# Altium schematic sheet Pg6-Power supply 3.SchDoc: Isolated Poser Supply 3
size 431 x 279 mm; Date: Not shown in title block; ApprovedBy: Not shown in title block; CheckedBy: Not shown in title block; Author: Not shown in title block; CompanyName: Not shown in title block; Engineer: Not shown in title block; Organization: Not shown in title block; Address1: Not shown in title block; Address2: Not shown in title block; Address3: Not shown in title block; Address4: Not shown in title block; DocumentNumber: 6; Revision: Use project parameter SCH_Rev; SheetNumber: 6; SheetTotal: 7; PageSetup: Record=PageOptions|CenterHorizontal=True|CenterVertical=True|PrintScale=1.00|XCorrection=1.00|YCorrection=1.00|PrintKind=0|BorderSize=5000000|LeftOffset=0|BottomOffset=0|Orientation=2|PaperLength=1000|PaperWidth=1000|Scale=100|PaperSource=15|PrintQuality=600|MediaType=1|DitherType=10|PaperKind=Letter|PrintScaleMode=1; CurrentTime: Not shown in title block; CurrentDate: Not shown in title block; Time: Not shown in title block; DocumentFullPathAndName: Not shown in title block; DocumentName: Not shown in title block; ModifiedDate: Not shown in title block; ImagePath: Not shown in title block
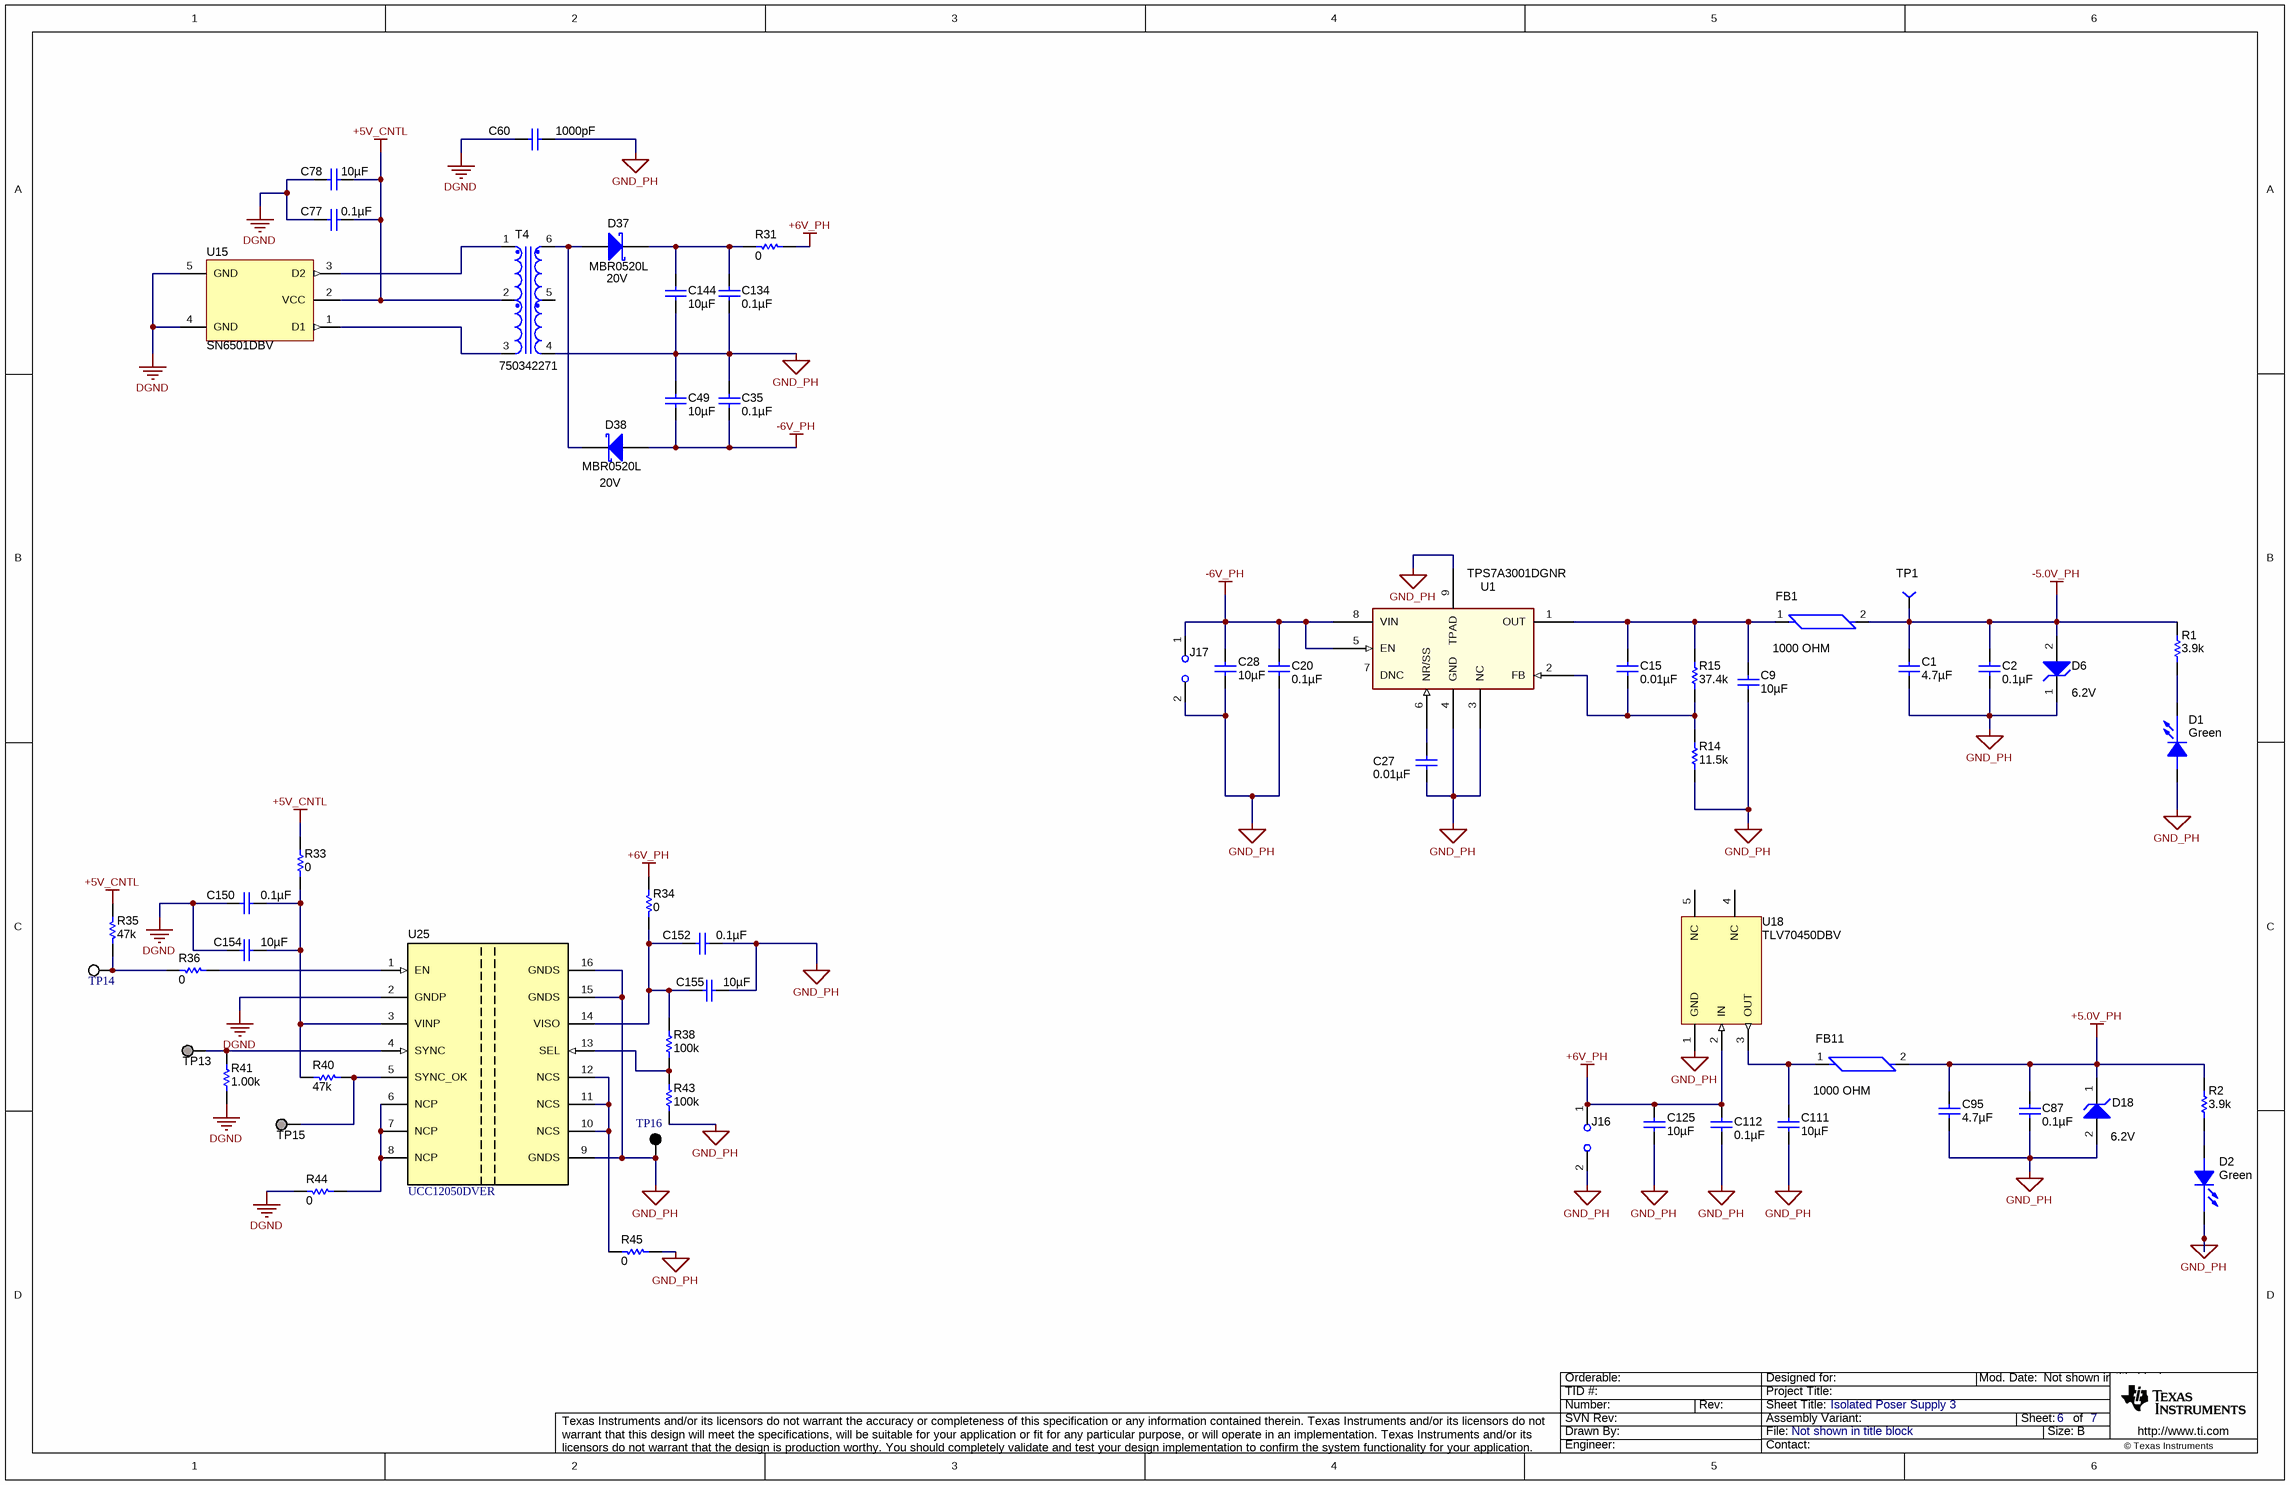
[diagram p0: Pg6-Power supply 3.SchDoc]

## Parts
C1  ValueDisplayed: 4.7µF  [0805_HV]
C2  ValueDisplayed: 0.1µF  [0603]
C9  ValueDisplayed: 10µF  [1210]
C15  ValueDisplayed: 0.01µF  [0603]
C20  ValueDisplayed: 0.1µF  [0603]
C27  ValueDisplayed: 0.01µF  [0603]
C28  ValueDisplayed: 10µF  [1210]
C35  ValueDisplayed: 0.1µF  [0603]
C49  ValueDisplayed: 10µF  [1210]
C60  value 1000pF  [CAP_200mil]
C77  ValueDisplayed: 0.1µF  [0603]
C78  ValueDisplayed: 10µF  [1210]
C87  ValueDisplayed: 0.1µF  [0603]
C95  ValueDisplayed: 4.7µF  [0805_HV]
C111  ValueDisplayed: 10µF  [1210]
C112  ValueDisplayed: 0.1µF  [0603]
C125  ValueDisplayed: 10µF  [1210]
C134  ValueDisplayed: 0.1µF  [0603]
C144  ValueDisplayed: 10µF  [1210]
C150  ValueDisplayed: 0.1µF  [0603]  (hidden comment: C0603C104K5RACTU)
C152  ValueDisplayed: 0.1µF  [0603]  (hidden comment: C0603C104K5RACTU)
C154  ValueDisplayed: 10µF  [1206_180]  (hidden comment: GRM31CR61H106KA12L)
C155  ValueDisplayed: 10µF  [1206_180]  (hidden comment: GRM31CR61H106KA12L)
D1  value Green  [LED0603AA]
D2  value Green  [LED0603AA]
D6  value 6.2V  [powerDI123]
D18  value 6.2V  [powerDI123]
D37  MBR0520L  value 20V  [SOD-123]
D38  MBR0520L  value 20V  [SOD-123]
FB1  value 1000 OHM  [FB0603]
FB11  value 1000 OHM  [FB0603]
J16  (no value)  [HDR100_1X2]
J17  (no value)  [HDR100_1X2]
R1  value 3.9k  [0603]
R2  value 3.9k  [0603]
R14  value 11.5k  [0603]
R15  value 37.4k  [0603]
R31  value 0  [0402M]  (hidden comment: RC0402JR-070RL)
R33  ValueDisplayed: 0  [0603]  (hidden comment: CRCW06030000Z0EA)
R34  ValueDisplayed: 0  [0603]  (hidden comment: CRCW06030000Z0EA)
R35  ValueDisplayed: 47k  [0603]  (hidden comment: RC0603JR-0747KL)
R36  value 0  [0402M]  (hidden comment: RC0402JR-070RL)
R38  ValueDisplayed: 100k  [0603]  (hidden comment: CRCW0603100KFKEA)
R40  ValueDisplayed: 47k  [0603]  (hidden comment: RC0603JR-0747KL)
R41  ValueDisplayed: 1.00k  [0402]  (hidden comment: ERJ-2RKF1001X)
R43  ValueDisplayed: 100k  [0603]  (hidden comment: CRCW0603100KFKEA)
R44  value 0  [0402M]  (hidden comment: RC0402JR-070RL)
R45  value 0  [0402M]  (hidden comment: RC0402JR-070RL)
T4  750342271  [760390015]
TP1  (no value)  [TP-040_RND]
TP13  Pogo Pad  [PogoPad]  (value not drawn)  (no BOM)
TP14  5002  [Keystone5002]  (value not drawn)
TP15  Pogo Pad  [PogoPad]  (value not drawn)  (no BOM)
TP16  5001  [Keystone5001]  (value not drawn)
U1  (no value)  [MSOP8(DGN)]
U15  SN6501DBV  [DBV0005A_N]
U18  TLV70450DBV  [DBV0005A_N]
U25  UCC12050DVER  [DVE0016A]

## Nets
+5.0V_PH: C87.1 C95.2 D18.1(K) FB11.2 R2.2
+5V_CNTL: C77.2 C78.2 R33.2 R35.2 T4.2 U15.2(VCC)
+6V_PH: C112.1 C125.2 J16.1 R31.1 R34.2 U18.2(IN)
-5.0V_PH: C1.2 C2.1 D6.2(A) FB1.2 R1.2 TP1.1
-6V_PH: C20.1 C28.2 C35.2 C49.2 D38.2(A) J17.1 U1.5(EN) U1.8(VIN)
DGND: C60.1 C77.1 C78.1 C150.1 C154.2 R41.1 R44.2 U15.4(GND) U15.5(GND) U25.2(GNDP)
GND_PH: C1.1 C2.2 C9.1 C20.2 C27.1 C28.1 C35.1 C49.1 C60.2 C87.2 C95.1 C111.1 C112.2 C125.1 C134.2 C144.2 C152.1 C155.1 D1.2(A) D2.1(C) D6.1(K) D18.2(A) J16.2 J17.2 R14.1 R43.1 R45.1 T4.4 TP16.1 U1.3(NC) U1.4(GND) U1.9(TPAD) U18.1(GND) U25.9(GNDS) U25.15(GNDS) U25.16(GNDS)
NetC9_2: C9.2 C15.2 FB1.1 R15.2 U1.1(OUT)
NetC15_1: C15.1 R14.2 R15.1 U1.2(FB)
NetC27_2: C27.2 U1.6(NR/SS)
NetC111_2: C111.2 FB11.1 U18.3(OUT)
NetC134_1: C134.1 C144.1 D37.1(K) R31.2
NetC150_2: C150.2 C154.1 R33.1 R40.2 U25.3(VINP)
NetC152_2: C152.2 C155.2 R34.1 R38.1 U25.14(VISO)
NetD1_1: D1.1(C) R1.1
NetD2_2: D2.2(A) R2.1
NetD37_2: D37.2(A) D38.1(K) T4.6
NetR35_1: R35.1 R36.2 TP14.1
NetR36_1: R36.1 U25.1(EN)
NetR38_2: R38.2 R43.2 U25.13(SEL)
NetR40_1: R40.1 TP15.1 U25.5(SYNC_OK)
NetR41_2: R41.2 TP13.1 U25.4(SYNC)
NetR44_1: R44.1 U25.6(NCP) U25.7(NCP) U25.8(NCP)
NetR45_2: R45.2 U25.10(NCS) U25.11(NCS) U25.12(NCS)
NetT4_1: T4.1 U15.3(D2)
NetT4_3: T4.3 U15.1(D1)

Not connected (* = marked no-connect by the designer): T4 5; U1 7(DNC); U18 4(NC) 5(NC)

## Notes on the sheet
- Drawn By:
- SVN Rev:
- Number:
- TID #:
- Orderable:
- Rev:
- Sheet Title:
- File:
- Project Title:
- Designed for:
- Assembly Variant:
- Mod. Date:
- Sheet:
- Size:
- of
- B
- http://www.ti.com
- Texas Instruments and/or its licensors do not warrant the accuracy or completeness of this specification or any information contained therein. Texas Instruments and/or its licensors do not warrant that this design will meet the specifications, will be suitable for your application or fit for any particular purpose, or will operate in an implementation. Texas Instruments and/or its licensors do not warrant that the design is production worthy. You should completely validate and test your design implementation to confirm the system functionality for your application.
- Engineer:
- Contact:
- © Texas Instruments

## Library data of the parts
C1 C95 = C2012X5R1H475K125AB: CAP, CERM, 4.7uF, 50V, +/-10%, X5R, 0805; Manufacturer: TDK; Polarized: N; CompType: Capacitor; U/M: EA; Cap_F: 0.0000047; Tolerance_%: 10; Value1: Unknown; VDC_V: 50; TaMin_C: -55; TaMax_C: 85; Cap_Case: 0805; PackageReference: 0805; PartNumber: C2012X5R1H475K125AB; SymbolVersion: 2008-07-09; Value: 4.7uF; RoHS: Y; Value2: 50V; MountType: SMT; Technology: Ceramic; Publisher: Texas Instruments; LatestRevisionDate: 2013-12-06; ComponentLink1Description: Datasheet link; ComponentLink1URL: http://product.tdk.com/capacitor/mlcc/en/productguide/pdf/mlcc_selection_guide_en_03.pdf; Supplier 1: Digi-Key; Supplier Part Number 1: 445-5980-1-ND; TempCo: X5R; Published: 2008-06-19
C2 C20 C35 C77 C87 C112 C134 C150 C152 = C0603C104K5RACTU: CAP, CERM, 0.1uF, 50V, +/-10%, X7R, 0603; Manufacturer: Kemet; Polarized: N; CompType: Capacitor; U/M: EA; Cap_F: 0.0000001; Tolerance_%: 10; Value1: Unknown; VDC_V: 50; TaMin_C: -55; TaMax_C: 125; SymbolVersion: 2008-07-09; Value: 0.1uF; PartNumber: C0603C104K5RACTU; PackageReference: 0603; RoHS: Y; Value2: 50V; MountType: SMT; Technology: Ceramic; TempCo: X7R; Cap_Case: 0603; Published: 2008-06-19; Publisher: Texas Instruments; LatestRevisionDate: 2013-12-06; ComponentLink1Description: Datasheet link; ComponentLink1URL: http://www.kemet.com/kemet/web/homepage/kechome.nsf/vapubfiles/F3102_Y5V.pdf/$file/F3102_Y5V.pdf; Supplier 1: Digi-Key; Supplier Part Number 1: 399-5089-1-ND; Supplier 2: Mouser; Supplier Part Number 2: 80-C0603C104K5R; Supplier 3: Farnell; Supplier Part Number 3: 1288255
C9 C28 C49 C78 C111 C125 C144 = GMK325AB7106MM-T: CAP, CERM, 10uF, 35V, +/-20%, X7R, 1210; Manufacturer: Taiyo Yuden; Polarized: N; CompType: Capacitor; U/M: EA; Cap_F: 0.00001; Tolerance_%: 20; Value1: Unknown; VDC_V: 35; TaMin_C: -55; TaMax_C: 125; PackageReference: 1210; PartNumber: GMK325AB7106MM-T; SymbolVersion: 2008-07-09; Value: 10uF; RoHS: Y; Value2: 35V; MountType: SMT; Technology: Ceramic; Cap_Case: 1210; Publisher: Texas Instruments; LatestRevisionDate: 2013-12-06; ComponentLink1Description: Datasheet link; ComponentLink1URL: http://www.yuden.co.jp/productdata/catalog/en/mlcc01_e.pdf; Supplier 1: Digi-Key; Supplier Part Number 1: 587-2779-1-ND; Supplier 2: Mouser; Supplier Part Number 2: 963-GMK325AB7106MM-T; Supplier 3: Farnell; Supplier Part Number 3: 1894510; TempCo: X7R; Published: 2008-06-19
C15 C27 = 06031C103JAT2A: CAP, CERM, 0.01uF, 100V, +/-5%, X7R, 0603; Manufacturer: AVX; Polarized: N; CompType: Capacitor; U/M: EA; Cap_F: 0.00000001; Tolerance_%: 5; ESR_Ohm: 0.098; Value1: 0.098 ohm; VDC_V: 100; TaMin_C: -55; TaMax_C: 125; SymbolVersion: 2008-07-09; Value: 0.01uF; PartNumber: 06031C103J4Z4A; PackageReference: 0603; RoHS: Y; Value2: 100V; MountType: SMT; Technology: Ceramic; TempCo: X7R; Cap_Case: 0603; Published: 2008-06-19; Publisher: Texas Instruments; LatestRevisionDate: 2013-11-21; ComponentLink1Description: Datasheet link; ComponentLink1URL: http://www.avx.com/docs/masterpubs/smccp.pdf; Supplier 1: Digi-Key; Supplier Part Number 1: 478-7418-1-ND; Supplier 2: Mouser; Supplier Part Number 2: 581-06031C103J; Supplier 3: Farnell; Supplier Part Number 3: 1833876
C60 = 202R18W102KV4E: CAP CER 1000PF 1KV 10% RADIAL; PartNumber: S102K29Y5PN63J5R; Manufacturer: Vishay BC Components; Polarized: N; CompType: Capacitor; Tolerance_%: 0; ValueDisplayed: 1000pF; RoHS: Y; Value2: 1kv; MountType: radial; Technology: Ceramic; Publisher: Texas Instruments; ComponentLink1Description: Datasheet link; ComponentLink1URL: http://www.johansondielectrics.com/images/stories/catalog/JDI-Product-Catalog.pdf; Supplier 1: Digi-Key; Supplier Part Number 1: 1251PH-ND
C154 C155 = GRM31CR61H106KA12L: CAP, CERM, 10 µF, 50 V, +/- 10%, X5R, 1206; Manufacturer: MuRata; Polarized: N; CompType: Capacitor; Value: 10uF; U/M: EA; Cap_F: 0.00001; Tolerance_%: 10; Value1: Unknown; VDC_V: 50; Value2: 50V; TaMin_C: -55; TaMax_C: 85; Cap_Case: 1206; SizeArea_mm2: 5.12; SizeAreaWB_mm2: 10.92; SizeX_mm: 3.2; SizeY_mm: 1.6; SizeZ_mm: 1.8; AEC Category: Q200; SymbolVersion: 2008-07-09; PartNumber: GRM31CR61H106KA12L; PackageReference: 1206; RoHS: Y; MountType: SMT; Technology: Ceramic; TempCo: X5R; Published: 2008-06-19; Publisher: Texas Instruments; LatestRevisionDate: 2016-10-28; ComponentLink1Description: Datasheet link; ComponentLink1URL: http://search.murata.co.jp/Ceramy/image/img/A01X/G101/ENG/GRM31CR61H106KA12-01.pdf; Supplier 1: Digi-Key; Supplier Part Number 1: 490-5961-1-ND; Supplier 2: Mouser; Supplier Part Number 2: 81-GRM31CR61H106KA2L; Supplier 3: Farnell; Supplier Part Number 3: 1845762RL; AEC Qualified: N; AEC Grade: N/A
D1 D2 = LED_LG L29K-G2J1-24-Z: LED SmartLED Green 570NM; Manufacturer: OSRAM; SymbolCreator: x0120606; CompType: *; PartNumber: LG L29K-G2J1-24-Z; Alternate Manufacturer: LED; PackageReference: 0603; ComponentLink1URL: http://catalog.osram-os.com/catalogue/catalogue.do;jsessionid=32CB61882C089EDD4B6D0A54E7E1F117?act=downloadFile&favOid=020000020000138e000100b6; Alternate PartNumber: *; ComponentLink1Description: Datasheet link; Supplier Part Number 1: 475-2709-2-ND; Supplier 1: Digi-Key; MountType: SMT; Publisher: TI
D6 D18 = DFLZ6V2-7: Diode, Zener, 6.2V, 1W, PowerDI123; Manufacturer: Diodes Inc.; U/M: EA; Power_W: 1; Vz_V: 6.2; RJA_CperW: 110; CompType: Zener; SymbolVersion: 2010-08-25; PartNumber: DFLZ6V2-7; PackageReference: PowerDI123; Vr_V: N/A; Value1: 1W; MountType: SMT; RoHS: Y; ComponentLink1Description: Datasheet link; ComponentLink1URL: http://www.diodes.com/datasheets/ds30464.pdf; Published: 2008-10-08; Publisher: Texas Instruments; LatestRevisionDate: 2013-11-26; LatestRevisionNote: Updated Supplier Data; Supplier 1: Digi-Key; Supplier Part Number 1: DFLZ6V2DICT-ND; Supplier 2: Mouser; Supplier Part Number 2: 621-DFLZ6V2-7; Supplier 3: Farnell; Supplier Part Number 3: 2077983
D37 D38 = MBR0520LT1G: Diode, Schottky, 20V, 0.5A, SOD-123; Manufacturer: Fairchild Semiconductor; U/M: EA; Vf_V: 0.385; Value2: 0.385V; Io_A: 0.5; Vr_V: 20; TJmax_C: 125; RJC_CperW: 150; CompType: Diode; SymbolVersion: 2008-12-08; PartNumber: MBR0520L; PackageReference: SOD-123; Value1: 0.5A; MountType: SMT; Type: Schottky; RoHS: Y; Published: 2008-06-26; Publisher: Texas Instruments; LatestRevisionDate: 2013-12-18; ComponentLink1Description: Datasheet link; ComponentLink1URL: http://www.onsemi.com/pub_link/Collateral/MBR0520LT1-D.PDF; Supplier 1: Digi-Key; Supplier Part Number 1: MBR0520LCT-ND; Supplier 2: Mouser; Supplier Part Number 2: 863-MBR0520LT1G; Supplier 3: Farnell; Supplier Part Number 3: 9556915
FB1 FB11 = MMZ1608B102C: FERRITE CHIP 1000 OHM 300MA 0603; Manufacturer: TDK Corporation; CompType: Ferrite Bead; PartNumber: MMZ1608B102C; MountType: SMT; Alternate PartNumber: *; Supplier 1: Digi-Key; ComponentLink1URL: http://www.tdk.co.jp/tefe02/e9412_mmz.pdf; ComponentLink1Description: Datasheet link; Publisher: TI; Supplier Part Number 1: 445-8672-1-ND; PackageReference: 0603; Alternate Manufacturer: *; RoHS: Y
J16 J17 = JUMPER_2X100MIL: Header, Male 2-pin, 100mil spacing,; Manufacturer: FCI; PartNumber: 68001-402HLF; area: 20000; Value: 68001-402HLF; ComponentLink1URL: \\vette02\pmp_pcb\pcad_pdf's\pec36saan.pdf; ComponentHeight: 0.330 inch; SymbolVersion: 09/30/2009 09:55:05; PackageReference: 0.100 inch x 2; ComponentLink1Description: AEO Datasheet Link; Supplier 1: Digi-Key; Supplier Part Number 1: 609-3507-ND
R1 R2 = CRCW06033K90JNEA: RES, 3.9k ohm, 5%, 0.1W, 0603; Manufacturer: Vishay-Dale; CompType: Resistor; Res_ohm: 3900; Value_Code: 3k90; Tolerance_%: 5; Power_W: 0.1; VDC_V: 75; TempCo: 200 ppm/C; EIA_Code: E24; U/M: EA; SymbolVersion: 2009-05-29; PartNumber: CRCW06033K90JNEA; PackageReference: 0603; RoHS: Y; Value1: 5%; Value2: 0.1W; MountType: SMT; Technology: Thick Film; Published: 2008-06-26; Publisher: Texas Instruments; LatestRevisionDate: 2013-10-22; ComponentLink1Description: Datasheet link; ComponentLink1URL: http://www.vishay.com/docs/20035/dcrcwe3.pdf; Supplier 1: Digi-Key; Supplier Part Number 1: 541-3.9KGCT-ND; Supplier 2: Farnell; Supplier Part Number 2: 1563917; Supplier 3: Newark; Supplier Part Number 3: 72M6834
R14 = CRCW060311K5FKEA: RES, 11.5k ohm, 1%, 0.1W, 0603; Manufacturer: Vishay-Dale; CompType: Resistor; Res_ohm: 11500; Value_Code: 11k5; Tolerance_%: 1; Power_W: 0.1; VDC_V: 75; TempCo: 100 ppm/C; EIA_Code: E96; U/M: EA; SymbolVersion: 2009-05-29; PartNumber: CRCW060311K5FKEA; PackageReference: 0603; RoHS: Y; Value1: 1%; Value2: 0.1W; MountType: SMT; Technology: Thick Film; Published: 2008-06-26; Publisher: Texas Instruments; LatestRevisionDate: 2013-10-22; ComponentLink1Description: Datasheet link; ComponentLink1URL: http://www.vishay.com/docs/20035/dcrcwe3.pdf; Supplier 1: Digi-Key; Supplier Part Number 1: 541-11.5KHCT-ND; Supplier 2: Mouser; Supplier Part Number 2: 71-CRCW0603-11.5K-E3; Supplier 3: Farnell; Supplier Part Number 3: 1469753
R15 = RT0603BRD0737KL: RES 37.4K OHM 1/10W .1% 0603 SMD; PartNumber: ERA-3AEB3742V; Manufacturer: Panasonic; CompType: Resistor; Res_ohm: 37000; Value_Code: 37k4; Tolerance_%: 0.1; Value1: 1%; Value2: 0.1W; VDC_V: 75; TempCo: 25 ppm/C; EIA_Code: E192; U/M: EA; SymbolVersion: 2009-05-29; PackageReference: 0603; RoHS: Y; Power_W: 0.1; MountType: SMT; Technology: Thin Film; Published: 2008-06-26; Publisher: Texas Instruments; LatestRevisionDate: 2013-10-22; ComponentLink1Description: Datasheet link; ComponentLink1URL: http://www.yageo.com/pdf/PYu-RT_1-to-0.05_RoHS_L_3.pdf; Supplier 1: Digi-Key; Supplier Part Number 1: P37.4KDBCT-ND
R31 R36 R44 R45 = RC0402JR-070RL: RES, 0 ohm, 5%, 0.063W, 0402; Manufacturer: Yageo America; CompType: Resistor; Value_Code: 0000; Tolerance_%: 5; Power_W: 0.063; VDC_V: 50; TempCo: 200 ppm/C; EIA_Code: E24; U/M: EA; SymbolVersion: 2009-05-29; PartNumber: RC0402JR-070RL; PackageReference: 0402; RoHS: Y; Res_ohm: 0; Value1: 5%; Value2: 0.063W; MountType: SMT; Technology: Thick Film; Published: 2008-06-26; Publisher: Texas Instruments; LatestRevisionDate: 2013-01-08; ComponentLink1Description: Datasheet link; ComponentLink1URL: http://www.yageo.com/pdf/Pu-RC0402_51_PbFree_L_2.pdf; Supplier 1: Digi-Key; Supplier Part Number 1: 311-0.0JRCT-ND; Supplier 2: Mouser; Supplier Part Number 2: 603-RC0402JR-070RL; Supplier 3: Farnell; Supplier Part Number 3: 9232516
R33 R34 = CRCW06030000Z0EA: RES, 0, 5%, 0.1 W, 0603; Manufacturer: Vishay-Dale; CompType: Resistor; Value: 0; Value_Code: 0000; Tolerance_%: 5; Power_W: 0.1; Value2: 0.1W; VDC_V: 75; TempCo: 200 ppm/C; EIA_Code: E24; U/M: EA; SymbolVersion: 2009-05-29; PartNumber: CRCW06030000Z0EA; PackageReference: 0603; RoHS: Y; Res_ohm: 0; Value1: 5%; MountType: SMT; Technology: Thick Film; Published: 2008-06-26; Publisher: Texas Instruments; LatestRevisionDate: 2014-10-21; ComponentLink1Description: Datasheet link; ComponentLink1URL: http://www.vishay.com/docs/20035/dcrcwe3.pdf; Supplier 1: Digi-Key; Supplier Part Number 1: 541-0.0GCT-ND; Supplier 2: Mouser; Supplier Part Number 2: 71-CRCW0603-0-E3; Supplier 3: Farnell; Supplier Part Number 3: 1469739
R35 R40 = RC0603JR-0747KL: RES, 47 k, 5%, 0.1 W, 0603; Manufacturer: Yageo America; CompType: Resistor; Value: 47k; Res_ohm: 47000; Value_Code: 47k0; Tolerance_%: 5; Power_W: 0.1; Value2: 0.1W; VDC_V: 50; TempCo: 100 ppm/C; EIA_Code: E24; U/M: EA; SymbolVersion: 2009-05-29; PartNumber: RC0603JR-0747KL; PackageReference: 0603; RoHS: Y; Value1: 5%; MountType: SMT; Technology: Thick Film; Published: 2008-06-26; Publisher: Texas Instruments; LatestRevisionDate: 2014-12-16; ComponentLink1Description: Datasheet link; ComponentLink1URL: http://www.yageo.com/pdf/Pu-RC0603_51_PbFree_L_2.pdf; Supplier 1: Digi-Key; Supplier Part Number 1: 311-47KGRCT-ND; Supplier 2: Mouser; Supplier Part Number 2: 603-RC0603JR-0747KL; Supplier 3: Farnell; Supplier Part Number 3: 9233580
R38 R43 = CRCW0603100KFKEA: RES, 100 k, 1%, 0.1 W, 0603; Manufacturer: Vishay-Dale; CompType: Resistor; Value: 100k; Res_ohm: 100000; Tolerance_%: 1; Power_W: 0.1; Value2: 0.1W; VDC_V: 75; TempCo: 100 ppm/C; SizeArea_mm2: 1.28; SizeX_mm: 1.6; SizeY_mm: 0.8; EIA_Code: E96; U/M: EA; AEC Category: Q200; Green_Lifecycle: Active; Green_REACh: Passed; SymbolVersion: 2009-05-29; PartNumber: CRCW0603100KFKEA; PackageReference: 0603; RoHS: Y; Value_Code: 100k; Value1: 1%; MountType: SMT; Technology: Thick Film; SizeZ_mm: 1; Published: 2008-06-26; Publisher: Texas Instruments; LatestRevisionDate: 2017-06-13; ComponentLink1Description: Datasheet link; ComponentLink1URL: http://www.vishay.com/docs/20035/dcrcwe3.pdf; Supplier 1: Digi-Key; Supplier Part Number 1: 541-100KHCT-ND; Supplier 2: Newark; Supplier Part Number 2: 42K3668; Supplier 3: Mouser; Supplier Part Number 3: 71-CRCW0603-100K-E3; AEC Qualified: ?; Green_EU RoHS: Passed with Exemption; Green_EU RoHS-2: Passed
R41 = ERJ-2RKF1001X: RES, 1.00 k, 1%, 0.1 W, 0402; Manufacturer: Panasonic; CompType: Resistor; Value: 1.00k; Res_ohm: 1000; Value_Code: 1k00; Tolerance_%: 1; Power_W: 0.1; Value2: 0.1W; VDC_V: 50; TempCo: 100 ppm/C; SizeArea_mm2: 0.5; SizeZ_mm: 0.6; EIA_Code: E96; U/M: EA; AEC Category: Q200; Green_Lifecycle: Active; Green_REACh: Passed; SymbolVersion: 2009-05-29; PartNumber: ERJ-2RKF1001X; PackageReference: 0402; RoHS: Y; Value1: 1%; MountType: SMT; Technology: Thick Film; SizeX_mm: 1; SizeY_mm: 0.5; Published: 2008-06-26; Publisher: Texas Instruments; LatestRevisionDate: 2017-06-12; ComponentLink1Description: Datasheet link; ComponentLink1URL: http://industrial.panasonic.com/www-data/pdf/AOA0000/AOA0000CE2.pdf; Supplier 1: Digi-Key; Supplier Part Number 1: P1.00KLCT-ND; Supplier 2: Newark; Supplier Part Number 2: 64R5247; Supplier 3: Mouser; Supplier Part Number 3: 667-ERJ-2RKF1001X; AEC Qualified: ?; Green_EU RoHS: Passed with Exemption; Green_EU RoHS-2: Passed
T4 = TRNSFMR: Transformer 469uH SMD; Manufacturer: Wurth Electronics Midcom; Alternate Manufacturer: *; RoHS: Y; Value: 469uH; MountType: SMT; PartNumber: 750342271; PackageReference: 10.05mm L x 6.73mm W; Publisher: TI; ComponentLink1Description: Datasheet Link; Alternate PartNumber: *; CompType: Transformer; Supplier 1: Digi-Key
TP1 = TP-040_RND: Test Point, O.040 Hole; Manufacturer: STD; Value: STD; area: *; SymbolVersion: 06/30/2008 16:03:57; PartNumber: STD; ComponentLink1Description: AEO Datasheet Link
TP13 TP15 = PogoPad: Pad for Pogo Pin Connector; SymbolCreator: codlsc; SymbolVersion: 2010-09-27; PackageReference: N/A; CompType: Pogo Pad; Publisher: Texas Instruments; LatestRevisionDate: 2016-08-13; LatestRevisionNote: Added Alternate PartNumber and Alternate Manufacturer parameters to appropriate components.
TP14 = 5002: Test Point, Miniature, White, TH; Manufacturer: Keystone; CompType: Test Point Loop; ContactFinish: Silver; Green_Lifecycle: Active; Green_REACh: Passed; SymbolVersion: 2008-04-04; PartNumber: 5002; PackageReference: White Miniature Testpoint; RoHS: Y; MountType: TH; ComponentLink1Description: Datasheet URL; ComponentLink1URL: http://www.keyelco.com/userAssets/file/M60-2p60.pdf; Color: White; Publisher: Texas Instruments; LatestRevisionDate: 2017-05-11; Supplier 1: Digi-Key; Supplier Part Number 1: 36-5002-ND; Supplier 2: Newark; Supplier Part Number 2: 82H9632; Supplier 3: Mouser; Supplier Part Number 3: 534-5002; Green_EU RoHS: Passed; Green_EU RoHS-2: Passed
TP16 = 5001: Test Point, Miniature, Black, TH; Manufacturer: Keystone; CompType: Test Point Loop; ContactFinish: Silver; Green_Lifecycle: Active; Green_REACh: Passed; SymbolVersion: 2008-04-04; PartNumber: 5001; PackageReference: Black Miniature Testpoint; RoHS: Y; MountType: TH; ComponentLink1Description: Datasheet URL; ComponentLink1URL: http://www.keyelco.com/userAssets/file/M60-2p60.pdf; Color: Black; Publisher: Texas Instruments; LatestRevisionDate: 2017-05-11; Supplier 1: Digi-Key; Supplier Part Number 1: 36-5001-ND; Supplier 2: Mouser; Supplier Part Number 2: 534-5001; Green_EU RoHS: Passed; Green_EU RoHS-2: Incomplete
U1 = TPS7A3001DGNR: -36V, -200mA, Ultralow-Noise, Negative Linear Regulator; Alternate Manufacturer: None; Manufacturer: Texas Instruments; CompType: IC; SymbolCreator: x0120606; ComponentLink1URL: http://www.ti.com/lit/ds/symlink/tps7a3001.pdf; ComponentLink1Description: Datasheet Link; Publisher: Texas Instruments; PackageReference: MSOP-PowerPAD (DGN) | 8; RoHS: Y; PartNumber: TPS7A3001DGNR; MountType: SMT
U15 = SN6501DBV: Transformer Driver for Isolated Power Supplies, DBV0005A; Alternate Manufacturer: None; Manufacturer: Texas Instruments; SymbolCreator: a0411947; CompType: IC; U/M: EA; SymbolVersion: 2013-06-28; PartNumber: SN6501DBV; PackageReference: DBV0005A; MountType: SMT; ComponentLink1Description: Datasheet Link; ComponentLink1URL: http://www.ti.com/lit/ds/symlink/sn6501.pdf; RoHS: Y; Publisher: Texas Instruments; LatestRevisionDate: 2013-12-23
U18 = TLV70450DBV: Regulator, LDO, 5V, 0.15A, SOT23-5; Alternate Manufacturer: None; Manufacturer: Texas Instruments; SymbolCreator: x0120606; CompType: IC; PartNumber: TLV70450DBV; PackageReference: DBV0005A; MountType: SMT; ComponentLink1Description: Datasheet Link; ComponentLink1URL: http://www.ti.com/lit/ds/symlink/tlv70450.pdf; RoHS: Y; Publisher: Texas Instruments
U25 = CMP-0081958-3: 500 mW, High-Efficiency, Low-Emissions, 5 kVRMS Isolated DC-DC Converter, DVE0016A (SO-MOD-16); Manufacturer: Texas Instruments; AEC Category: Q200; CompType: IC; SizeAreaWB_mm2: 151.29; SizeZ_mm: 2.65; AEC Qualified: N; SizeArea_mm2: 106.09; SizeY_mm: 10.3; Operating Temperature Range: -40 to 125 C; MountType: SMT; PackageReference: DVE0016A; ComponentLink1Description: Datasheet Link; PartNumber: UCC12050DVER; ComponentLink3URL: http://www.ti.com/product/ucc12050/datasheet; Alternate PartNumber: UCC12050DVE; ComponentLink2URL: http://www.ti.com/product/ucc12050; ComponentLink3Description: Online Datasheet; ComponentLink2Description: Product Folder; PackageDescription: SO-MOD-16; ComponentLink1URL: http://www.ti.com/lit/ds/symlink/ucc12050.pdf; Alternate Manufacturer: Texas Instruments; SizeX_mm: 10.3